# EAGLE design line_follower (EAGLE 8.1.0)
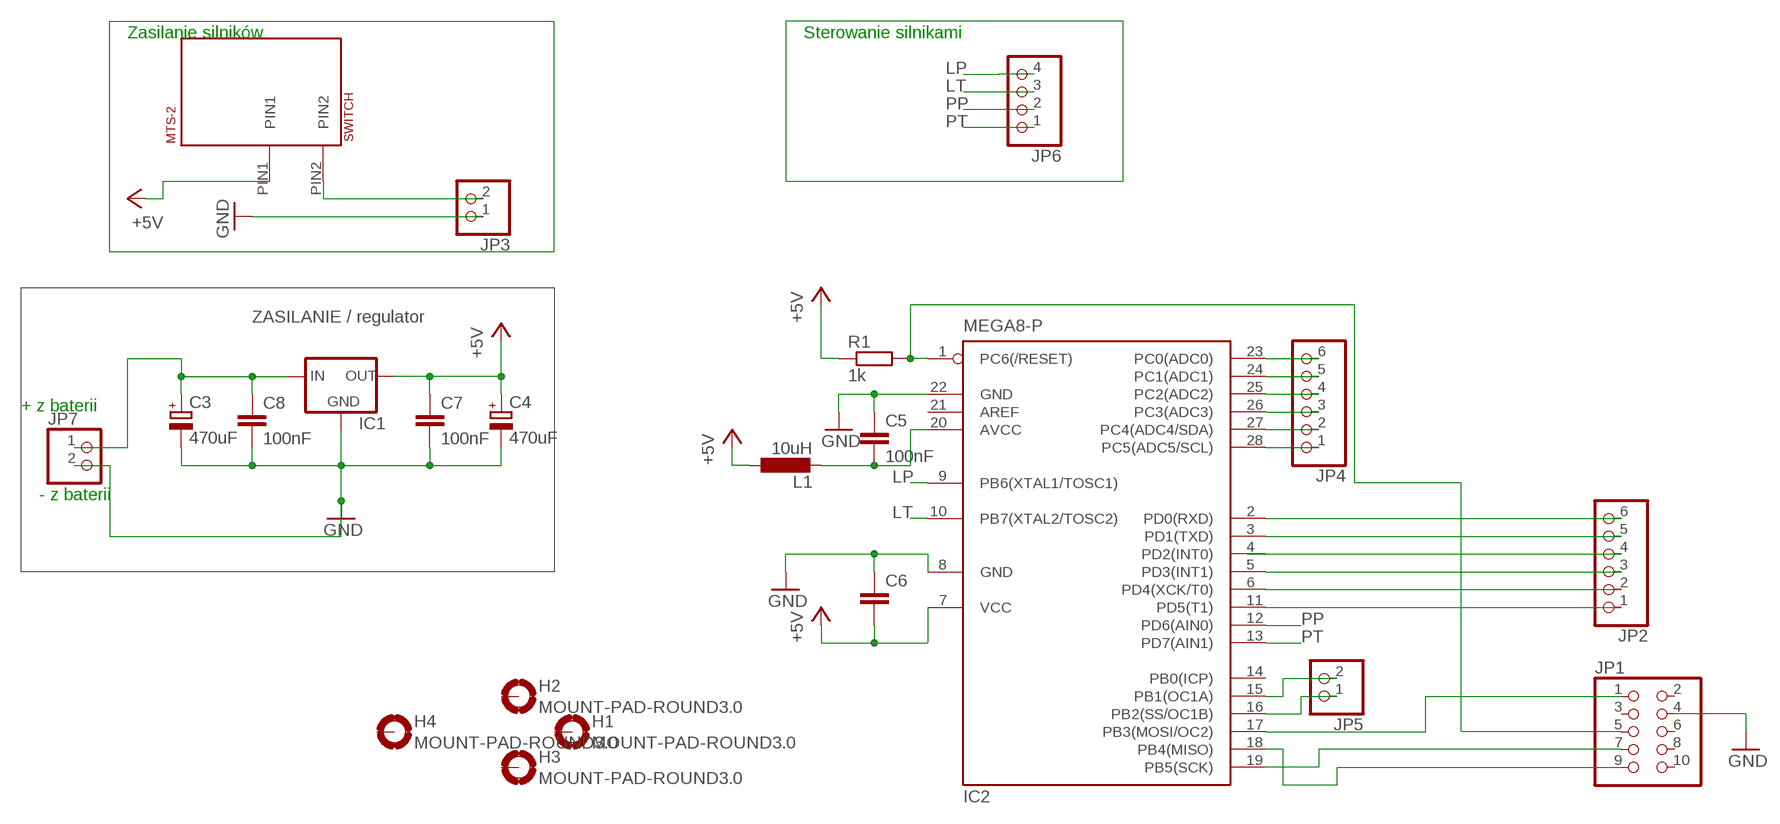
[diagram p0: schematic, sheet 1]

## Parts
C3  470uF  CPOL-EUE2.5-6  [E2,5-6]
C4  470uF  CPOL-EUE2.5-6  [E2,5-6]
C5  100nF  C-EU025-025X050  [C025-025X050]
C6  C-EU025-025X050  [C025-025X050]
C7  100nF  C-EU025-025X050  [C025-025X050]
C8  100nF  C-EU025-025X050  [C025-025X050]
H1  MOUNT-PAD-ROUND3.0  [3,0-PAD]
H2  MOUNT-PAD-ROUND3.0  [3,0-PAD]
H3  MOUNT-PAD-ROUND3.0  [3,0-PAD]
H4  MOUNT-PAD-ROUND3.0  [3,0-PAD]
IC1  78XXS  [78XXS]
IC2  MEGA8-P  [DIL28-3]
JP1  PINHD-2X5  [2X05]
JP2  PINHD-1X6  [1X06]
JP3  PINHD-1X2  [1X02]
JP4  PINHD-1X6  [1X06]
JP5  PINHD-1X2  [1X02]
JP6  PINHD-1X4  [1X04]
JP7  PINHD-1X2  [1X02]
L1  10uH  L-EU0207/5V  [0207/5V]
MTS-2  SWITCH  [MTS-2_SWITCH]
R1  1k  R-EU_0204/5  [0204/5]

## Nets
+5V: C4.+ C6.2 C7.1 IC1.OUT IC2.7(VCC) L1.1 MTS-2.PIN1 R1.1
GND: C3.- C4.- C5.1 C6.1 C7.2 C8.2 IC1.GND IC2.8(GND) IC2.22(GND) JP1.4 JP3.1 JP7.2
LP: IC2.9(PB6(XTAL1/TOSC1)) JP6.4
LT: IC2.10(PB7(XTAL2/TOSC2)) JP6.3
N$1: C5.2 IC2.20(AVCC) L1.2
N$2: IC2.23(PC0(ADC0)) JP4.6
N$3: IC2.1(PC6(/RESET)) JP1.5 R1.2
N$4: IC2.17(PB3(MOSI/OC2)) JP1.1
N$5: IC2.18(PB4(MISO)) JP1.9
N$6: IC2.2(PD0(RXD)) JP2.6
N$7: IC2.19(PB5(SCK)) JP1.7
N$8: IC2.3(PD1(TXD)) JP2.5
N$9: IC2.4(PD2(INT0)) JP2.4
N$10: IC2.5(PD3(INT1)) JP2.3
N$11: IC2.6(PD4(XCK/T0)) JP2.2
N$12: IC2.11(PD5(T1)) JP2.1
N$13: C3.+ C8.1 IC1.IN JP7.1
N$14: IC2.24(PC1(ADC1)) JP4.5
N$15: IC2.25(PC2(ADC2)) JP4.4
N$16: IC2.26(PC3(ADC3)) JP4.3
N$17: IC2.27(PC4(ADC4/SDA)) JP4.2
N$18: IC2.28(PC5(ADC5/SCL)) JP4.1
N$19: IC2.15(PB1(OC1A)) JP5.2
N$20: IC2.16(PB2(SS/OC1B)) JP5.1
N$22: JP3.2 MTS-2.PIN2
PP: IC2.12(PD6(AIN0)) JP6.2
PT: IC2.13(PD7(AIN1)) JP6.1
Unconnected: H1.B3,0(MOUNT) H2.B3,0(MOUNT) H3.B3,0(MOUNT) H4.B3,0(MOUNT) IC2.14(PB0(ICP)) IC2.21(AREF) JP1.2 JP1.3 JP1.6 JP1.8 JP1.10

## Notes on the sheet
- Zasilanie silników | Sterowanie silnikami
- ZASILANIE / regulator
- + z baterii
- - z baterii

## Library data of the parts
C3 C4 = rcl:CPOL-EU: POLARIZED CAPACITOR, European symbol
C5-C8 = rcl:C-EU: CAPACITOR, European symbol
H1-H4 = holes:MOUNT-PAD-ROUND: MOUNTING PAD, round
IC1 = v-reg:78XXS: VOLTAGE REGULATOR
IC2 = atmel:MEGA8-P: MICROCONTROLLER 8 Kbytes FLASH, 1 kbytes SRAM, 512 bytes EEPROM, USART, 4-channel 10 bit ADC, 2-channel 8 bit ADC Pin compatible with Atmega48, ATMega88, ATMega168 Source: avr.lbr; OC_FARNELL: unknown; OC_NEWARK: unknown
JP1 = pinhead:PINHD-2X5: PIN HEADER
JP2 JP4 = pinhead:PINHD-1X6: PIN HEADER
JP3 JP5 JP7 = pinhead:PINHD-1X2: PIN HEADER
JP6 = pinhead:PINHD-1X4: PIN HEADER
L1 = rcl:L-EU: INDUCTOR, European symbol
MTS-2 = MTS-2:SWITCH
R1 = rcl:R-EU_: RESISTOR, European symbol

## Board
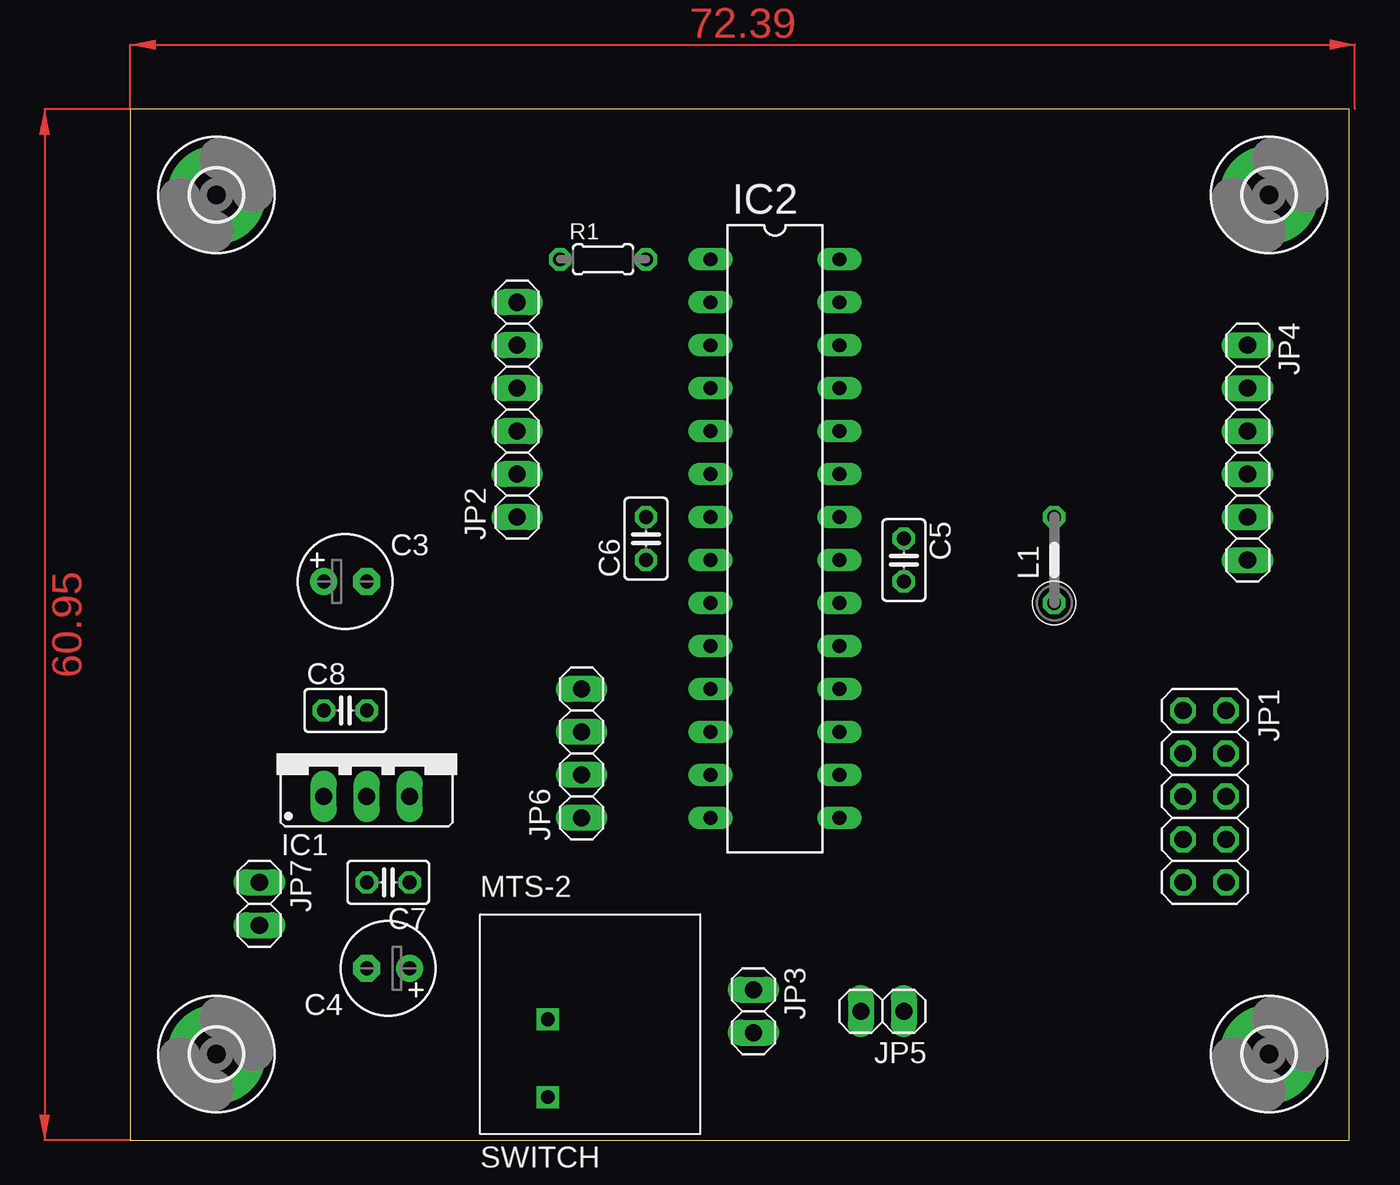
[diagram p1: board, top side]
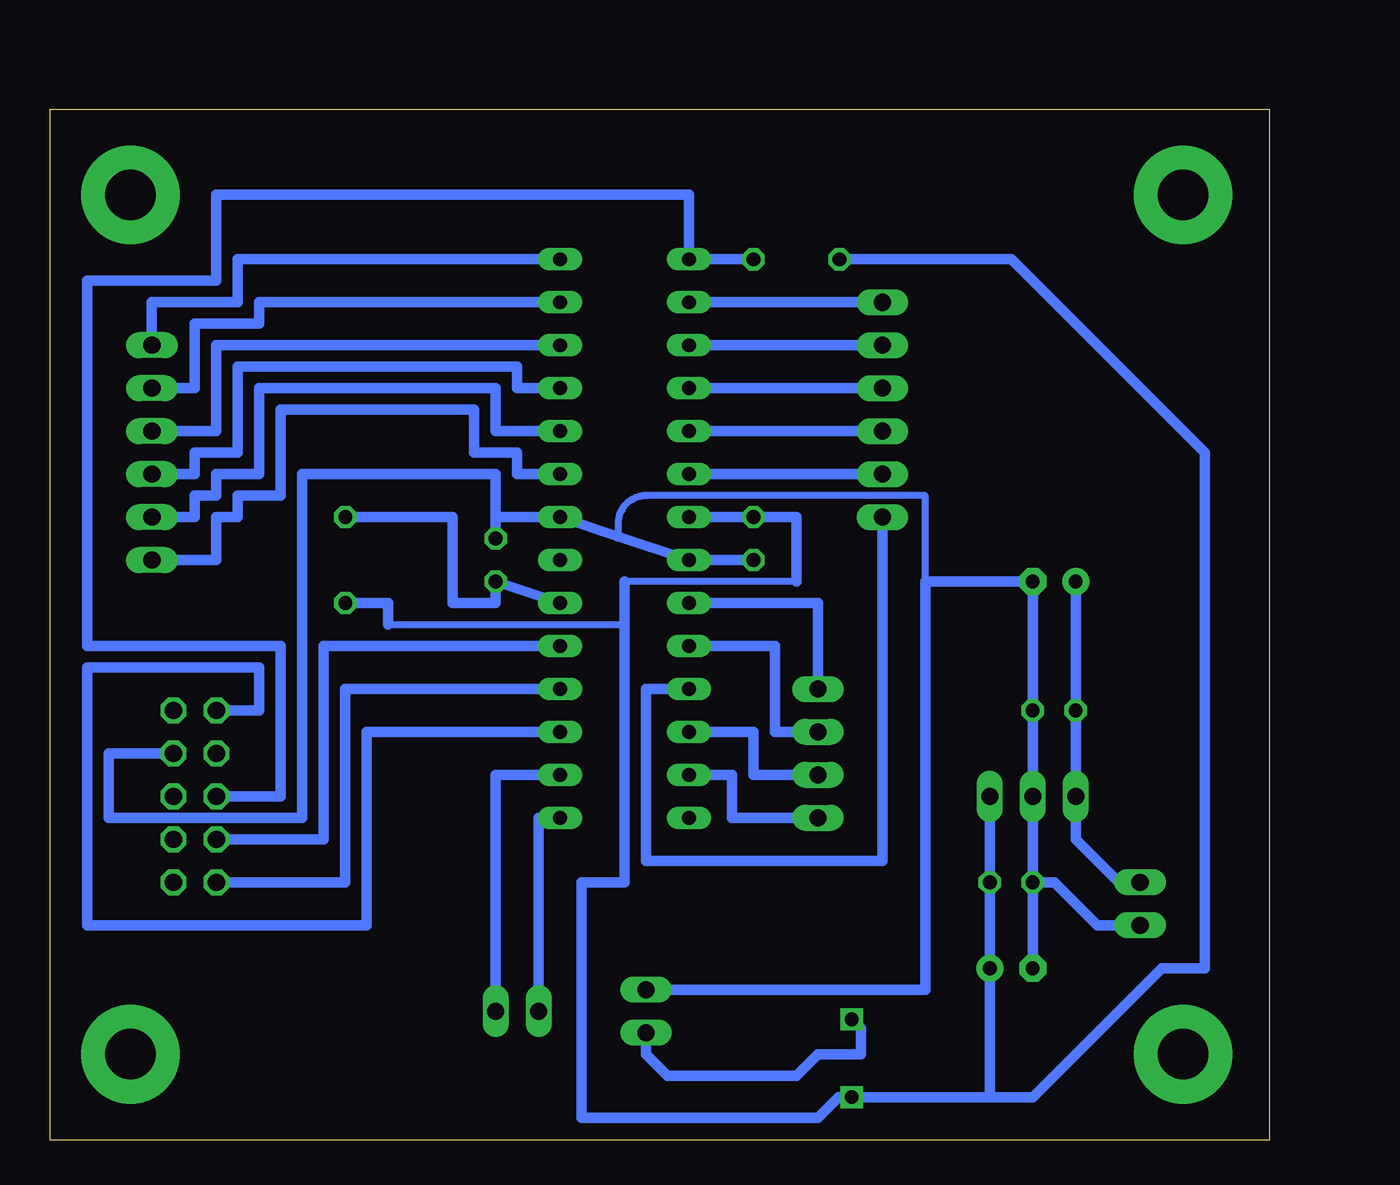
[diagram p2: board, bottom side, seen from below]

Size 72.06 x 60.95 mm. Coordinates in mm from the lower left corner, seen from the top.
Outline: 0,0 72.06,0 72.06,60.95 0,60.95 0,0
Copper layers (1*16): Top 0.035mm / dielectric 1.5mm / Bottom 0.035mm
Design rules "default": minimum track width 10mil, minimum drill 24mil, track to track 8mil, track to pad 8mil, pad to pad 8mil, via to via 8mil, smd to smd 8mil, copper to edge 40mil, drill to drill 8mil, minimum pad ring 10mil, minimum via ring 8mil, stop-mask expansion 4mil, vias tented up to drill 0mil, thermal gap 10mil

### Footprints (pad centres in the part's own frame; a part is rotated, then mirrored left to right if it is on the bottom)
E2,5-6 = drill 0.813 pad 1.6: + -1.27,0 | drill 0.813 pad 1.6 octagon: - 1.27,0
C025-025X050 = drill 0.813 octagon: 1 -1.27,0; 2 1.27,0
3,0-PAD = drill 3 pad 5.842: B3,0 0,0
78XXS = drill 1.016 long: GND 0,-2.54; IN -2.54,-2.54; OUT 2.54,-2.54
DIL28-3 = drill 0.813 long: 1 -16.51,-3.81; 2 -13.97,-3.81; 3 -11.43,-3.81; 4 -8.89,-3.81; 5 -6.35,-3.81; 6 -3.81,-3.81; 7 -1.27,-3.81; 8 1.27,-3.81; 9 3.81,-3.81; 10 6.35,-3.81; 11 8.89,-3.81; 12 11.43,-3.81; 13 13.97,-3.81; 14 16.51,-3.81; 15 16.51,3.81; 16 13.97,3.81; 17 11.43,3.81; 18 8.89,3.81; 19 6.35,3.81; 20 3.81,3.81; 21 1.27,3.81; 22 -1.27,3.81; 23 -3.81,3.81; 24 -6.35,3.81; 25 -8.89,3.81; 26 -11.43,3.81; 27 -13.97,3.81; 28 -16.51,3.81
2X05 = drill 1.016 octagon: 1 -5.08,-1.27; 2 -5.08,1.27; 3 -2.54,-1.27; 4 -2.54,1.27; 5 0,-1.27; 6 0,1.27; 7 2.54,-1.27; 8 2.54,1.27; 9 5.08,-1.27; 10 5.08,1.27
1X06 = drill 1.016 long: 1 -6.35,0; 2 -3.81,0; 3 -1.27,0; 4 1.27,0; 5 3.81,0; 6 6.35,0
1X02 = drill 1.016 long: 1 -1.27,0; 2 1.27,0
1X04 = drill 1.016 long: 1 -3.81,0; 2 -1.27,0; 3 1.27,0; 4 3.81,0
0207/5V = drill 0.813 octagon: 1 -2.54,0; 2 2.54,0
MTS-2_SWITCH = drill 0.8 square: PIN1 -2,-3.81; PIN2 -2,0.79
0204/5 = drill 0.813 octagon: 1 -2.54,0; 2 2.54,0

### Placement (x,y rotation side)
C3  12.7,33.02 0 top
C4  15.24,10.16 180 top
C5  45.72,34.29 270 top
C6  30.48,35.56 90 top
C7  15.24,15.24 180 top
C8  12.7,25.4 0 top
H1  5.08,5.08 0 top
H2  67.31,55.88 0 top
H3  67.31,5.08 0 top
H4  5.08,55.88 0 top
IC1  13.97,22.86 0 top
IC2  38.1,35.56 270 top
JP1  63.5,20.32 270 top
JP2  22.86,43.18 90 top
JP3  36.83,7.62 270 top
JP4  66.04,40.64 270 top
JP5  44.45,7.62 180 top
JP6  26.67,22.86 90 top
JP7  7.62,13.97 270 top
L1  54.61,34.29 90 top
MTS-2  26.67,6.35 0 top
R1  27.94,52.07 0 top

### Tracks (layer width: path | path; a pad name or v marks a point on that pad's centre or on a via)
+5V
  Bottom 0.406: 52.07,30.48 38.1,30.48 | 27.94,33.02 38.1,33.02
  Bottom 0.61: L1.1 52.07,31.75 52.07,30.48 | 38.1,33.02 38.1,30.48 38.1,15.24 40.64,15.24 40.64,1.32 26.67,1.32 25.45,2.54 MTS-2.PIN1 16.51,2.54 | 16.51,2.54 C4.+ C7.1 IC1.OUT | IC2.7 C6.2 27.94,36.83 27.94,33.02 | R1.1 15.24,52.07 3.81,40.64 3.81,10.16 6.35,10.16 13.97,2.54 16.51,2.54
GND
  Bottom 0.406: 20.32,33.02 20.32,38.1 36.83,38.1 arc-90 38.48,36.45 38.48,35.69
  Bottom 0.61: JP1.4 68.58,22.86 68.58,19.05 57.15,19.05 57.15,39.37 45.72,39.37 C5.1 45.72,36.83 IC2.22 38.48,35.69 IC2.8 C6.1 | C7.2 C4.- | C7.2 IC1.GND C8.2 C3.- 20.32,33.02 20.32,8.89 JP3.1 | JP7.2 10.16,12.7 12.7,15.24 C7.2
LP
  Bottom 0.61: IC2.9 26.67,31.75 JP6.4
LT
  Bottom 0.61: JP6.3 29.21,24.13 29.21,29.21 IC2.10
N$1
  Bottom 0.61: IC2.20 C5.2 45.72,31.75 48.26,31.75 48.26,36.83 L1.2
N$2
  Bottom 0.61: JP4.6 62.23,34.29 62.23,36.83 60.96,36.83 60.96,38.1 58.42,38.1 58.42,43.18 46.99,43.18 46.99,40.64 44.45,40.64 44.45,39.37 IC2.23
N$3
  Bottom 0.61: R1.2 IC2.1 34.29,55.88 62.23,55.88 62.23,50.8 69.85,50.8 69.85,29.21 58.42,29.21 58.42,20.32 JP1.5
N$4
  Bottom 0.61: IC2.17 53.34,24.13 53.34,12.7 69.85,12.7 69.85,27.94 59.69,27.94 59.69,25.4 JP1.1
N$5
  Bottom 0.61: JP1.9 54.61,15.24 54.61,26.67 IC2.18
N$6
  Bottom 0.61: JP2.6 IC2.2
N$7
  Bottom 0.61: IC2.19 55.88,29.21 55.88,17.78 JP1.7
N$8
  Bottom 0.61: IC2.3 JP2.5
N$9
  Bottom 0.61: IC2.4 JP2.4
N$10
  Bottom 0.61: IC2.5 JP2.3
N$11
  Bottom 0.61: IC2.6 JP2.2
N$12
  Bottom 0.61: JP2.1 22.86,16.51 36.83,16.51 36.83,26.67 IC2.11
N$13
  Bottom 0.61: C3.+ C8.1 IC1.IN 11.43,17.78 8.89,15.24 JP7.1
N$14
  Bottom 0.61: JP4.5 63.5,36.83 63.5,38.1 62.23,38.1 62.23,39.37 59.69,39.37 59.69,44.45 45.72,44.45 45.72,41.91 IC2.24
N$15
  Bottom 0.61: JP4.4 63.5,39.37 63.5,40.64 60.96,40.64 60.96,45.72 44.45,45.72 44.45,44.45 IC2.25
N$16
  Bottom 0.61: JP4.3 62.23,41.91 62.23,46.99 IC2.26
N$17
  Bottom 0.61: JP4.2 63.5,44.45 63.5,48.26 59.69,48.26 59.69,49.53 IC2.27
N$18
  Bottom 0.61: JP4.1 66.04,49.53 60.96,49.53 60.96,52.07 IC2.28
N$19
  Bottom 0.61: JP5.2 43.18,19.05 IC2.15
N$20
  Bottom 0.61: JP5.1 45.72,21.59 IC2.16
N$22
  Bottom 0.61: JP3.2 36.83,5.08 35.56,3.81 27.94,3.81 26.67,5.08 24.13,5.08 24.13,6.6 MTS-2.PIN2
PP
  Bottom 0.61: IC2.12 30.48,24.13 30.48,21.59 JP6.2
PT
  Bottom 0.61: IC2.13 31.75,21.59 31.75,19.05 JP6.1
(copper drawn outside any net)
  shapes: Top area x2